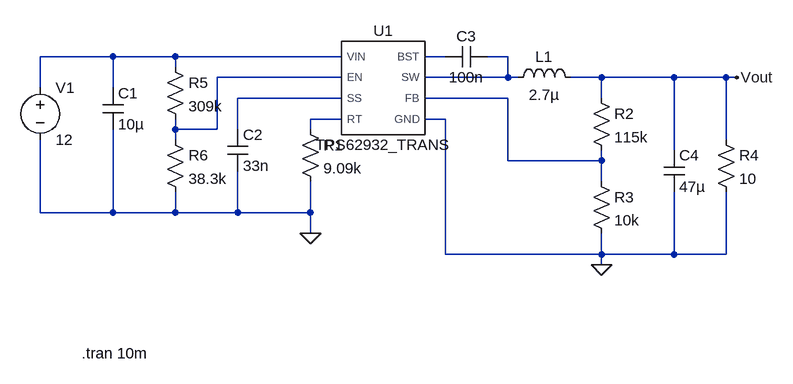
[diagram p0: schematic 12V_Buck.asc]
12V_Buck.asc, the LTspice schematic file:
Version 4
SHEET 1 1448 932
WIRE 48 48 -64 48
WIRE 144 48 48 48
WIRE 400 48 144 48
WIRE 560 48 528 48
WIRE 656 48 624 48
WIRE 144 64 144 48
WIRE 400 80 208 80
WIRE 656 80 656 48
WIRE 656 80 528 80
WIRE 672 80 656 80
WIRE 800 80 752 80
WIRE 912 80 800 80
WIRE 992 80 912 80
WIRE 1008 80 992 80
WIRE -64 96 -64 48
WIRE 48 96 48 48
WIRE 400 112 240 112
WIRE 656 112 528 112
WIRE 800 112 800 80
WIRE 400 144 352 144
WIRE 560 144 528 144
WIRE 144 160 144 144
WIRE 208 160 208 80
WIRE 208 160 144 160
WIRE 240 160 240 112
WIRE 352 160 352 144
WIRE 144 176 144 160
WIRE 992 176 992 80
WIRE 912 192 912 80
WIRE 656 208 656 112
WIRE 800 208 800 192
WIRE 800 208 656 208
WIRE 800 240 800 208
WIRE -64 288 -64 176
WIRE 48 288 48 160
WIRE 48 288 -64 288
WIRE 144 288 144 256
WIRE 144 288 48 288
WIRE 240 288 240 224
WIRE 240 288 144 288
WIRE 352 288 352 240
WIRE 352 288 240 288
WIRE 352 320 352 288
WIRE 560 352 560 144
WIRE 800 352 800 320
WIRE 800 352 560 352
WIRE 912 352 912 256
WIRE 912 352 800 352
WIRE 992 352 992 256
WIRE 992 352 912 352
WIRE 800 368 800 352
FLAG 1008 80 Vout
FLAG 352 320 0
FLAG 800 368 0
SYMBOL voltage -64 80 R0
WINDOW 123 0 0 Left 0
WINDOW 39 0 0 Left 0
SYMATTR InstName V1
SYMATTR Value 12
SYMBOL MD_Models\\TPS62932 464 96 R0
SYMATTR InstName U1
SYMATTR Value TPS62932_TRANS
SYMBOL cap 32 96 R0
SYMATTR InstName C1
SYMATTR Value 10µ
SYMBOL cap 224 160 R0
SYMATTR InstName C2
SYMATTR Value 33n
SYMBOL res 336 144 R0
SYMATTR InstName R1
SYMATTR Value 9.09k
SYMBOL cap 560 64 R270
WINDOW 0 32 32 VTop 2
WINDOW 3 0 32 VBottom 2
SYMATTR InstName C3
SYMATTR Value 100n
SYMBOL ind 656 96 R270
WINDOW 0 32 56 VTop 2
WINDOW 3 5 56 VBottom 2
SYMATTR InstName L1
SYMATTR Value 2.7µ
SYMBOL res 784 96 R0
SYMATTR InstName R2
SYMATTR Value 115k
SYMBOL res 784 224 R0
SYMATTR InstName R3
SYMATTR Value 10k
SYMBOL cap 896 192 R0
SYMATTR InstName C4
SYMATTR Value 47µ
SYMBOL res 976 160 R0
SYMATTR InstName R4
SYMATTR Value 10
SYMBOL res 128 48 R0
SYMATTR InstName R5
SYMATTR Value 309k
SYMBOL res 128 160 R0
SYMATTR InstName R6
SYMATTR Value 38.3k
TEXT 0 504 Left 2 !.tran 10m

The netlist it stands for:
* 12V_Buck.asc
V1 N001 0 12
XU1 N002 N004 N006 0 N007 N005 N003 N001 TPS62932_TRANS  ; pins BST EN FB GND RT SS SW VIN
C1 N001 0 10µ
C2 N005 0 33n
R1 N007 0 9.09k
C3 N002 N003 100n
L1 N003 Vout 2.7µ
R2 Vout N006 115k
R3 N006 0 10k
C4 Vout 0 47µ
R4 Vout 0 10
R5 N001 N004 309k
R6 N004 0 38.3k
.tran 10m
.lib TPS62932.txt
.backanno
.end